# Altium schematic sheet 16-DPLL_Spare_UFL.SchDoc
size C; SheetNumber: 15; SheetTotal: 15
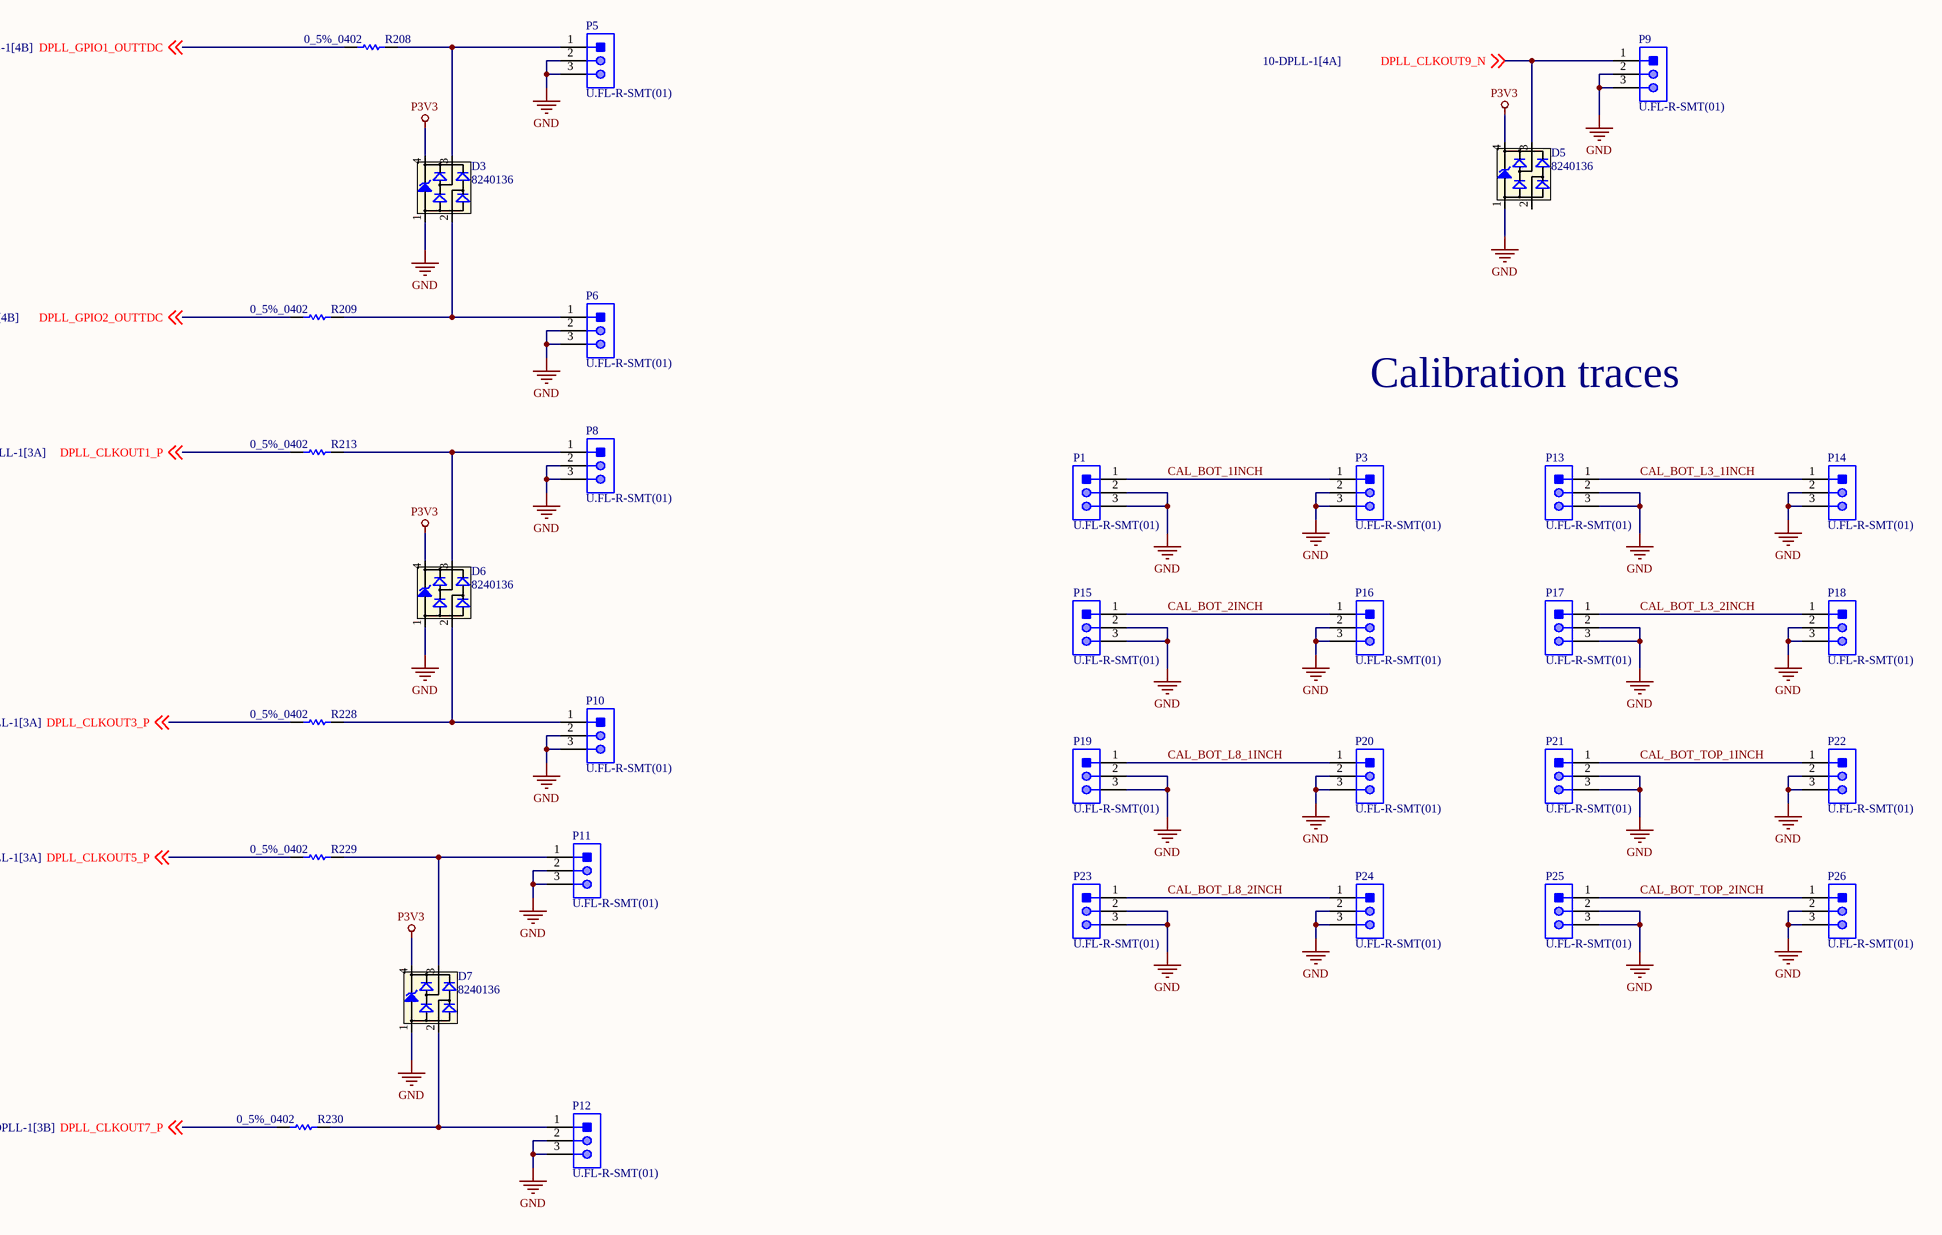
[diagram p0: 16-DPLL_Spare_UFL.SchDoc]

## Parts
D3  8240136  [SOT143-4L]
D5  8240136  [SOT143-4L]
D6  8240136  [SOT143-4L]
D7  8240136  [SOT143-4L]
P1  U.FL-R-SMT(01)  [HRS-U.FL-R-SMT(10)_V]
P3  U.FL-R-SMT(01)  [HRS-U.FL-R-SMT(10)_V]
P5  U.FL-R-SMT(01)  [HRS-U.FL-R-SMT(10)_V]
P6  U.FL-R-SMT(01)  [HRS-U.FL-R-SMT(10)_V]
P8  U.FL-R-SMT(01)  [HRS-U.FL-R-SMT(10)_V]
P9  U.FL-R-SMT(01)  [HRS-U.FL-R-SMT(10)_V]
P10  U.FL-R-SMT(01)  [HRS-U.FL-R-SMT(10)_V]
P11  U.FL-R-SMT(01)  [HRS-U.FL-R-SMT(10)_V]
P12  U.FL-R-SMT(01)  [HRS-U.FL-R-SMT(10)_V]
P13  U.FL-R-SMT(01)  [HRS-U.FL-R-SMT(10)_V]
P14  U.FL-R-SMT(01)  [HRS-U.FL-R-SMT(10)_V]
P15  U.FL-R-SMT(01)  [HRS-U.FL-R-SMT(10)_V]
P16  U.FL-R-SMT(01)  [HRS-U.FL-R-SMT(10)_V]
P17  U.FL-R-SMT(01)  [HRS-U.FL-R-SMT(10)_V]
P18  U.FL-R-SMT(01)  [HRS-U.FL-R-SMT(10)_V]
P19  U.FL-R-SMT(01)  [HRS-U.FL-R-SMT(10)_V]
P20  U.FL-R-SMT(01)  [HRS-U.FL-R-SMT(10)_V]
P21  U.FL-R-SMT(01)  [HRS-U.FL-R-SMT(10)_V]
P22  U.FL-R-SMT(01)  [HRS-U.FL-R-SMT(10)_V]
P23  U.FL-R-SMT(01)  [HRS-U.FL-R-SMT(10)_V]
P24  U.FL-R-SMT(01)  [HRS-U.FL-R-SMT(10)_V]
P25  U.FL-R-SMT(01)  [HRS-U.FL-R-SMT(10)_V]
P26  U.FL-R-SMT(01)  [HRS-U.FL-R-SMT(10)_V]
R208  0_5%_0402  [RESC1005X40X25LL10T10]
R209  0_5%_0402  [RESC1005X40X25LL10T10]
R213  0_5%_0402  [RESC1005X40X25LL10T10]
R228  0_5%_0402  [RESC1005X40X25LL10T10]
R229  0_5%_0402  [RESC1005X40X25LL10T10]
R230  0_5%_0402  [RESC1005X40X25LL10T10]

## Nets
GND: D3.1(GND) D5.1(GND) D6.1(GND) D7.1(GND) P1.2 P1.3 P3.2 P3.3 P5.2 P5.3 P6.2 P6.3 P8.2 P8.3 P9.2 P9.3 P10.2 P10.3 P11.2 P11.3 P12.2 P12.3 P13.2 P13.3 P14.2 P14.3 P15.2 P15.3 P16.2 P16.3 P17.2 P17.3 P18.2 P18.3 P19.2 P19.3 P20.2 P20.3 P21.2 P21.3 P22.2 P22.3 P23.2 P23.3 P24.2 P24.3 P25.2 P25.3 P26.2 P26.3
P3V3: D3.4(VDD) D5.4(VDD) D6.4(VDD) D7.4(VDD)
CAL_BOT_1INCH: P1.1 P3.1
CAL_BOT_2INCH: P15.1 P16.1
CAL_BOT_L3_1INCH: P13.1 P14.1
CAL_BOT_L3_2INCH: P17.1 P18.1
CAL_BOT_L8_1INCH: P19.1 P20.1
CAL_BOT_L8_2INCH: P23.1 P24.1
CAL_BOT_TOP_1INCH: P21.1 P22.1
CAL_BOT_TOP_2INCH: P25.1 P26.1
DPLL_CLKOUT1_P: R213.1 ; off-sheet DPLL_CLKOUT1_P
DPLL_CLKOUT3_P: R228.1 ; off-sheet DPLL_CLKOUT3_P
DPLL_CLKOUT5_P: R229.1 ; off-sheet DPLL_CLKOUT5_P
DPLL_CLKOUT7_P: R230.1 ; off-sheet DPLL_CLKOUT7_P
DPLL_CLKOUT9_N: D5.3(I/O2) P9.1 ; off-sheet DPLL_CLKOUT9_N
DPLL_GPIO1_OUTTDC: R208.1 ; off-sheet DPLL_GPIO1_OUTTDC
DPLL_GPIO2_OUTTDC: R209.1 ; off-sheet DPLL_GPIO2_OUTTDC
NetD3_2: D3.2(I/O1) P6.1 R209.2
NetD3_3: D3.3(I/O2) P5.1 R208.2
NetD6_2: D6.2(I/O1) P10.1 R228.2
NetD6_3: D6.3(I/O2) P8.1 R213.2
NetD7_2: D7.2(I/O1) P12.1 R230.2
NetD7_3: D7.3(I/O2) P11.1 R229.2

Not connected (* = marked no-connect by the designer): D5 2(I/O1)

## Notes on the sheet
- Calibration traces

## Library data of the parts
D3 D5-D7 = CMP-1486-00002-1: TVS Diode WE-TVS-HS, VRWM=3.3V; Manufacturer: Wuerth Elektronik; Reverse Stand Off Voltage: 3.3V; PartNumber: 8240136; ComponentLink1Description: Manufacturer URL; PackageReference: SOT143-4L; ComponentLink1URL: http://www.we-online.com; ComponentLink2Description: Datasheet; ComponentLink2URL: http://katalog.we-online.de/kataloge/eisos/media/pdf/8240136.pdf
P1 P3 P5 P6 P8-P26 = CMP-2000-05151-1: CONN RECPT ULTRA-MINI COAX SMD; Manufacturer: Hirose Electric; Centre Contact Resistance: 25mohm; Voltage Rating V AC: 60V; Female Contact Material: PhosphorBronze; Contact Resistance: 10mohm; Male Contact Material: Brass; Connector Type: UFLCoaxial; Connector Mounting: PCB; Impedance: 50ohm; Insulation Resistance: 500Mohm; Secondary Insulation Material: PBT; Frequency Max: 6GHz; Body Plating: Silver; External Length / Height: 2.5mm; Approval Category: UL94V-0; Female Contact Plating: Gold; Connector Mounting Orientation: PCBoard; VSWR: 1.3; Coaxial Termination: Solder; Body Style: StraightJack; SVHC: NoSVHC(18-Jun-2012); Jacket Material: LCP; Package Reference: U.FL-R-SMT(10); Datasheet Version: Feb-04; Outer Contact Resistance: 10mohm; Contact Plating: Gold; Mounting Type: PCBoard; Flammability Rating: UL94V-0; Operating Frequency Max: 6GHz; Termination Method: Solder; Male Contact Plating: Gold; Package Description: 3-Pin Surface Mount Device, Body 2.6 x 2.6 mm; Operating Temperature Min: -40degC; Manufacturer URL: https://www.hirose.com; Operating Temperature Max: 90degC; Contact Material: PhosphorBronze; Datasheet URL: http://www.farnell.com/datasheets/91524.pdf; Material: PhosphorBronze
R208 R209 R213 R228-R230 = CMP-2002-04569-1: Manufacturer: KOA Speer; Part Number: RK73Z1ETTP